# Altium schematic sheet schéma_TC1.SchDoc
size A4
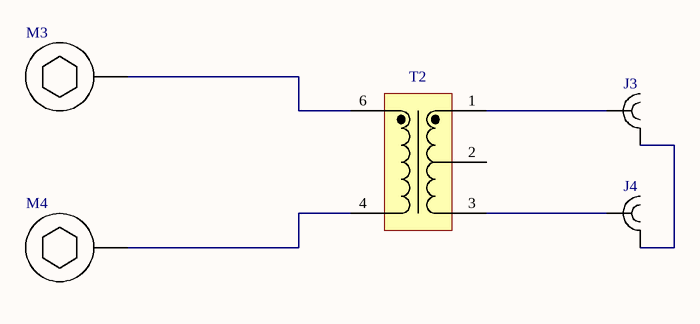
[diagram p0: schéma_TC1.SchDoc]

## Parts
J3  CONSMA001-G  [SMA TH Vertical Linx CONSMA001-G]  (value not drawn)
J4  CONSMA001-G  [SMA TH Vertical Linx CONSMA001-G]  (value not drawn)
M3  (no value)  [Screw Hex Socket M2.5X4 Connected]
M4  (no value)  [Screw Hex Socket M2.5X4 Connected]
T2  {Value}  [TC1-1TG2+]  (value not drawn)

## Nets
NetJ3_1: J3.1 T2.1
NetJ3_2: J3.2 J4.2
NetJ4_1: J4.1 T2.3
NetM3_1: M3.1 T2.6
NetM4_1: M4.1 T2.4

Not connected (* = marked no-connect by the designer): T2 2

## Library data of the parts
J3 J4 = SMA TH VERTICAL LINX CONSMA001-G: Value: CONSMA001-G
M3 M4 = Screw Hex Socket Connected: Screw Hex Socket Connected BN610
T2 = TC1-1TG2+: Mini-Circuits RF Transformer; Value: {Value}